# EAGLE design main (EAGLE 7.7.0)
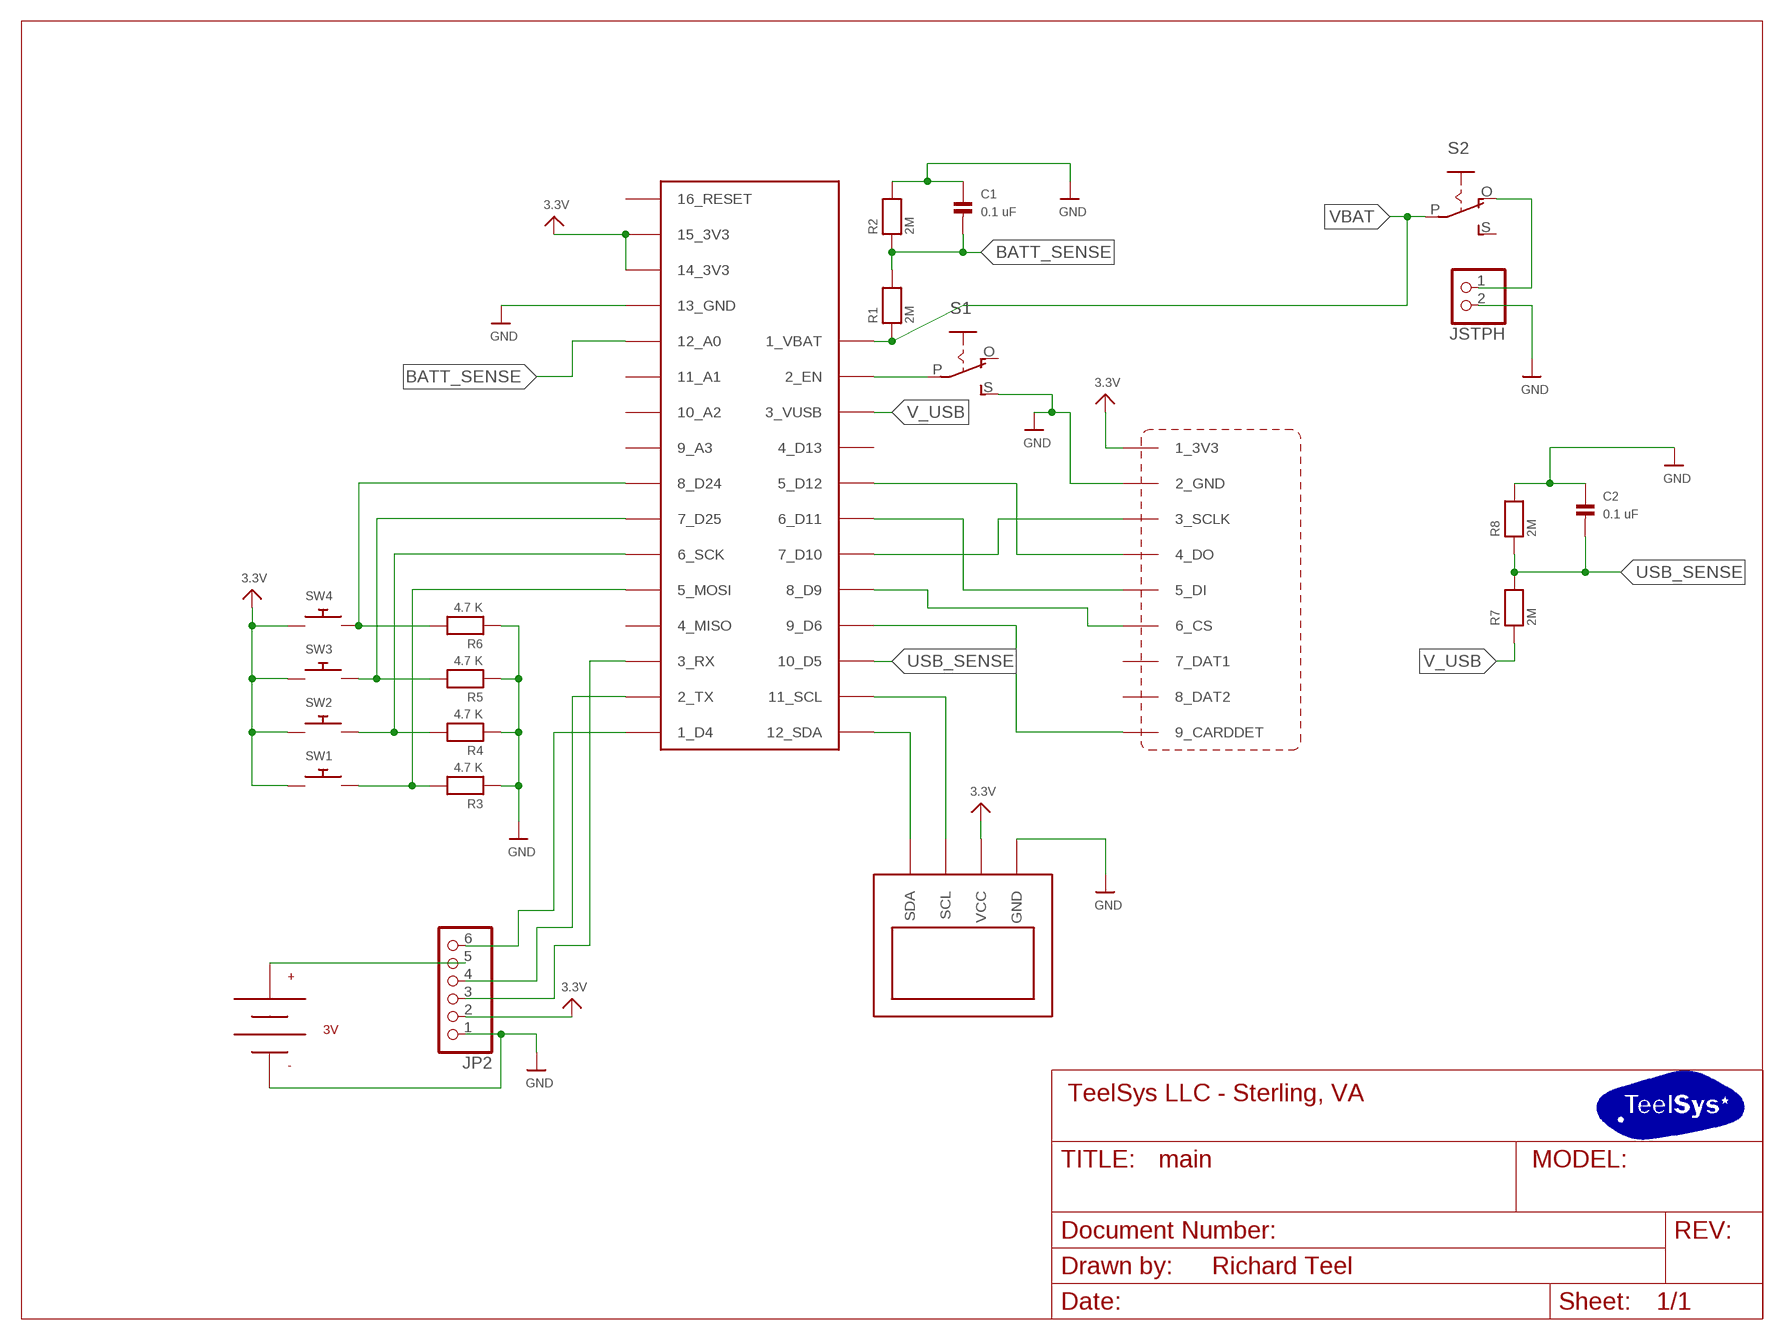
[diagram p0: schematic, sheet 1]
FRAME1 (LETTER_L): COMPANY_INFO: TeelSys LLC - Sterling, VA; DRAWN_BY: Richard Teel

## Parts
BAT_1  CR2032_HOLDER_WMYCONGCONG  [CR2032_HOLDER_WMYCONGCONG]
C1  0.1 uF  CAP_CERAMIC_0805  [_0805]
C2  0.1 uF  CAP_CERAMIC_0805  [_0805]
FEATHER_RP2040  ADAFRUIT_FEATHER_RP2040  [ADAFRUIT_FEATHER]
JP2  HEADER-1X6ROUND  [1X06_ROUND]
JSTPH  JST_2PIN-SMT-RA  [JST-PH-2-SMT-RA]
R1  2M  RESISTOR0805  [0805]
R2  2M  RESISTOR0805  [0805]
R3  4.7 K  RESISTOR0805  [0805]
R4  4.7 K  RESISTOR0805  [0805]
R5  4.7 K  RESISTOR0805  [0805]
R6  4.7 K  RESISTOR0805  [0805]
R7  2M  RESISTOR0805  [0805]
R8  2M  RESISTOR0805  [0805]
S1  EG1218S  [EG1218]
S2  EG1218S  [EG1218]
SDCARD2  ADAFRUIT_SDCARD3V3BOTTOM_MNT  [ADAFRUIT_SDCARD3V3_B]
SW1  SWITCH_PUSHBUTTONEVQ-PE  [TACT_PANA-EVQ]
SW2  SWITCH_PUSHBUTTONEVQ-PE  [TACT_PANA-EVQ]
SW3  SWITCH_PUSHBUTTONEVQ-PE  [TACT_PANA-EVQ]
SW4  SWITCH_PUSHBUTTONEVQ-PE  [TACT_PANA-EVQ]
U$10  OLED_SDD1306_128X64FRIENDA  [OLED_SDD1306_128X64]

## Nets
3.3V: FEATHER_RP2040.14_3V3 FEATHER_RP2040.15_3V3 JP2.2 SDCARD2.1_3V3 SW1.P$1 SW2.P$1 SW3.P$1 SW4.P$1 U$10.2_VCC(VCC)
BATT_SENSE: C1.2 FEATHER_RP2040.12_A0 R1.2 R2.1
GND: BAT_1.V-(-) C1.1 C2.1 FEATHER_RP2040.13_GND JP2.1 JSTPH.2 R2.2 R3.1 R4.1 R5.1 R6.1 R8.2 S1.S SDCARD2.2_GND U$10.1_GND(GND)
N$1: FEATHER_RP2040.9_D6 SDCARD2.9_CARDDET
N$2: FEATHER_RP2040.5_D12 SDCARD2.4_DO
N$3: FEATHER_RP2040.7_D10 SDCARD2.3_SCLK
N$4: FEATHER_RP2040.6_D11 SDCARD2.5_DI
N$5: FEATHER_RP2040.8_D9 SDCARD2.6_CS
N$7: FEATHER_RP2040.2_EN S1.P
N$8: FEATHER_RP2040.8_D24 R6.2 SW4.P$2
N$9: FEATHER_RP2040.7_D25 R5.2 SW3.P$2
N$10: FEATHER_RP2040.6_SCK R4.2 SW2.P$2
N$11: FEATHER_RP2040.5_MOSI R3.2 SW1.P$2
N$12: BAT_1.V+(+) JP2.5
N$13: FEATHER_RP2040.12_SDA U$10.4_SDA(SDA)
N$14: FEATHER_RP2040.11_SCL U$10.3_SCL(SCL)
N$17: JSTPH.1 S2.O
N$18: FEATHER_RP2040.3_RX JP2.3
N$19: FEATHER_RP2040.2_TX JP2.4
N$20: FEATHER_RP2040.1_D4 JP2.6
USB_SENSE: C2.2 FEATHER_RP2040.10_D5 R7.2 R8.1
V_USB: FEATHER_RP2040.3_VBUS(3_VUSB) R7.1
VBAT: FEATHER_RP2040.1_VBAT R1.1 S2.P
Unconnected: FEATHER_RP2040.4_D13 FEATHER_RP2040.4_MISO FEATHER_RP2040.9_A3 FEATHER_RP2040.10_A2 FEATHER_RP2040.11_A1 FEATHER_RP2040.16_RESET S1.O S2.S SDCARD2.7_DAT1 SDCARD2.8_DAT2

## Library data of the parts
BAT_1 = TeelSys-0.3:CR2032_HOLDER_WMYCONGCONG: https://smile.amazon.com/gp/product/B06XF3K4NP/ref=ppx_yo_dt_b_asin_image_o04_s00?ie=UTF8&psc=1 WMYCONGCONG 30 PCS CR2032 CR2025 Coin Button Cell Battery Holder Case, Black
C1 C2 = microbuilder:CAP_CERAMIC: Ceramic Capacitors 0402 - 0402 Surface Mount Capacitors 16pF 50V 5% [Digikey: 445-4899-2-ND] 18pF 50V 5% [Digikey: 490-1281-2-ND] 22pF 50V 5% [Digikey: 490-1283-2-ND] 68pF 50V 5% [Digikey: 490-1289-2-ND] 0.1uF 10V 10% [Digikey: 490-1318-2-ND] 1.0uF 6.3V 10% [Digikey: 490-1320-2-ND] 0603 - 0603 Surface Mount Capacitors 16 pF 50V 5% [Digikey: 445-5051-2-ND] 22 pF 50V [Digikey: PCC220ACVTR-ND] 33 pF 50V 5% [Digikey: 490-1415-1-ND] 56pF 50V 5% [Digikey: 490-1421-1-ND] 220pF 50V 5% [Digikey: 445-1285-1-ND] 680 pF 50V 2200 pF 50V 5% C0G [Digikey: 445-1297-1-ND] 5600 pF 100V 5% X7R [Digikey: 478-3711-1-ND] 0.1 µF 25V 10% [Digikey: PCC2277TR-ND] 0.22 µF 16V 10% X7R [Digikey: 445-1318-1-ND] 1.0 µF 25V 10% [Digikey: 445-5146-2-ND] 0603 - RF Specific 3pF 250V +/-0.1pF RF [Digikey: 712-1347-1-ND] 18 pF 250V 5% [Digikey: 478-3505-1-ND or 712-1322-1-ND] 56 pF 250V 5% C0G RF [Digikey: 490-4867-1-ND] 68 pF 250V RF [Digikey: 490-4868-1-ND] 0805 - 0805 Surface Mount Capacitors 220 pF 250V 2% RF Ceramic Capacitor [Digikey: 712-1398-1-ND] 1000 pF 50V 2% NP0 Ceramic Capacitor [Digikey: 478-3760-1-ND] 0.1 µF 25V 10% Ceramic Capacitor [Digikey: PCC1828TR-ND] 1.0 µF 16V 10% Ceramic Capacitor[Digikey: 490-1691-2-ND] 10.0 µF 10V 10% Ceramic Capacitor[Digikey: 709-1228-1-ND] 10.0 uF 16V 10% Ceramic Capacitor [Digikey: 478-5165-2-ND] 47 uF 6.3V 20% Ceramic Capacitor [Digikey: 587-1779-1-ND or 399-5506-1-ND] 1206 - 1206 Surface Mount Capacitors 47uF 10V 20% Ceramic Capacitor [Digikey: 490-5528-1-ND or 399-5508-1-ND or 445-6010-1-ND] 100uF 6.3V -20%, +80% Y5V Ceramic Capacitor (Digikey: 490-4512-1-ND, Mouser: 81-GRM31CF50J107ZE1L)
FEATHER_RP2040 = TeelSys-0.3:ADAFRUIT_FEATHER_RP2040; ADAFRUIT_PN: 4884
JP2 = microbuilder:HEADER-1X6: PIN HEADER
JSTPH = adafruit:JST_2PIN: JST 2-Pin Connectors of various flavors SMT-RA (S2B-PH-SM4) 4UConnector #17311 SMT (B2B-PH-SM4) THM-RA (S2B-PH) THM (B2B-PH)
R1-R8 = microbuilder:RESISTOR: Resistors 0402 - 0402 Surface Mount Package 22 Ohm 1% 1/16W [Digikey: 311-22.0LRTR-ND] 33 Ohm 5% 1/16W 1.0K 5% 1/16W 1.5K 5% 1/16W 2.0K 1% 1/16W 10.0K 1% 1/16W [Digikey: 311-10.0KLRTR-ND] 10.0K 5% 1/16W [Digikey: RMCF0402JT10K0TR-ND] 12.1K 1% 1/16W [Digikey: 311-22.0LRTR-ND] 100.0K 5% 1/16W 0603 - 0603 Surface Mount Package 0 Ohm 1/10 Watt 1% Resistor 15 Ohm 1/10 Watt 1% Resistor 33 Ohm 1/10 Watt 1% Resistor 49.9 Ohm 1/10 Watt 1% Resistor 100 Ohm 1/10 Watt 1% Resistor 150 Ohm 1/10 Watt 1% Resistor 240 Ohm 1/10 Watt 1% Resistor 390 Ohm 1/10 Watt 1% Resistor 560 Ohm 1/10 Watt 1% Resistor 680 Ohm 1/10 Watt 1% Resistor 750 Ohm 1/10 Watt 1% Resistor 1.0K Ohm 1/10 Watt 1% Resistor 1.5K Ohm 1/10 Watt 1% Resistor 2.0K Ohm 1/10 Watt 1% Resistor 2.2K Ohm 1/10 Watt 1% Resistor 3.3K Ohm 1/10 Watt 1% Resistor 4.7K Ohm 1/10 Watt 1% Resistor 10.0K Ohm 1/10 Watt 1% Resistor 12.0K Ohm 1/10 Watt 1% Resistor 12.1K Ohm 1/10 Watt 1% Resistor 20.0K Ohm 1/10 Watt 1% Resistor 33.0K Ohm 1/10 Watt 1% Resistor 100.0K Ohm 1/10 Watt 1% Resistor 0805 - 0805 Surface Mount Package 0 Ohm 1/8 Watt 1% Resistor 33 Ohm 1/8 Watt 1% Resistor 100 Ohm 1/8 Watt 1% Resistor 150 Ohm 1/8 Watt 1% Resistor 200 Ohm 1/8 Watt 1% Resistor 240 Ohm 1/8 Watt 1% Resistor 330 Ohm 1/8 Watt 1% Resistor 390 Ohm 1/8 Watt 1% Resistor 470 Ohm 1/8 Watt 1% Resistor 1.0K Ohm 1/8 Watt 1% Resistor 1.5K Ohm 1/8 Watt 1% Resistor 2.0K Ohm 1/8 Watt 1% Resistor 4.7K Ohm 1/8 Watt 1% Resistor 5.1K Ohm 1/8 Watt 1% Resistor 5.6K Ohm 1/8 Watt 1% Resistor 10.0K Ohm 1/8 Watt 1% Resistor 22.0K Ohm 1/8 Watt 1% Resistor 33.0K Ohm 1/8 Watt 1% Resistor 100K Ohm 1/8 Watt 1% Resistor 1206 - 1206 Surface Mount Package 2012 - 2010 Surface Mount Package 0.11 Ohm 1/2 Watt 1% Resistor - Digikey: RHM.11UCT-ND
S1 S2 = adafruit:EG1218: SLIDING SWITCH 0.1" spacing through hole, vertical SPDT slide switch http://www.ladyada.net/library/pcb/eaglelibrary.html
SDCARD2 = TeelSys-0.3:ADAFRUIT_SDCARD3V3: https://www.adafruit.com/product/4682
SW1-SW4 = adafruit:SWITCH_PUSHBUTTON: Buttons SOFTTOUCHSMD_SJ - Soft touch temporary push button (Super Junk Akihabara) Compatible with SKPMANE010 [Mouser: 688-SKPMAN] C&K_KSS = Digikey: KSS221GLFS
U$10 = TeelSys-0.3:OLED_SDD1306_128X64: Amazon - https://smile.amazon.com/gp/product/B08QJ7BL3R/ref=ppx_yo_dt_b_asin_image_o05_s00?ie=UTF8&th=1 Frienda 5 Pieces 0.96 Inch OLED Module 12864 128x64 Driver IIC I2C Serial Self-Luminous Display Board Compatible with Arduino Raspberry PI (Blue)

## Board
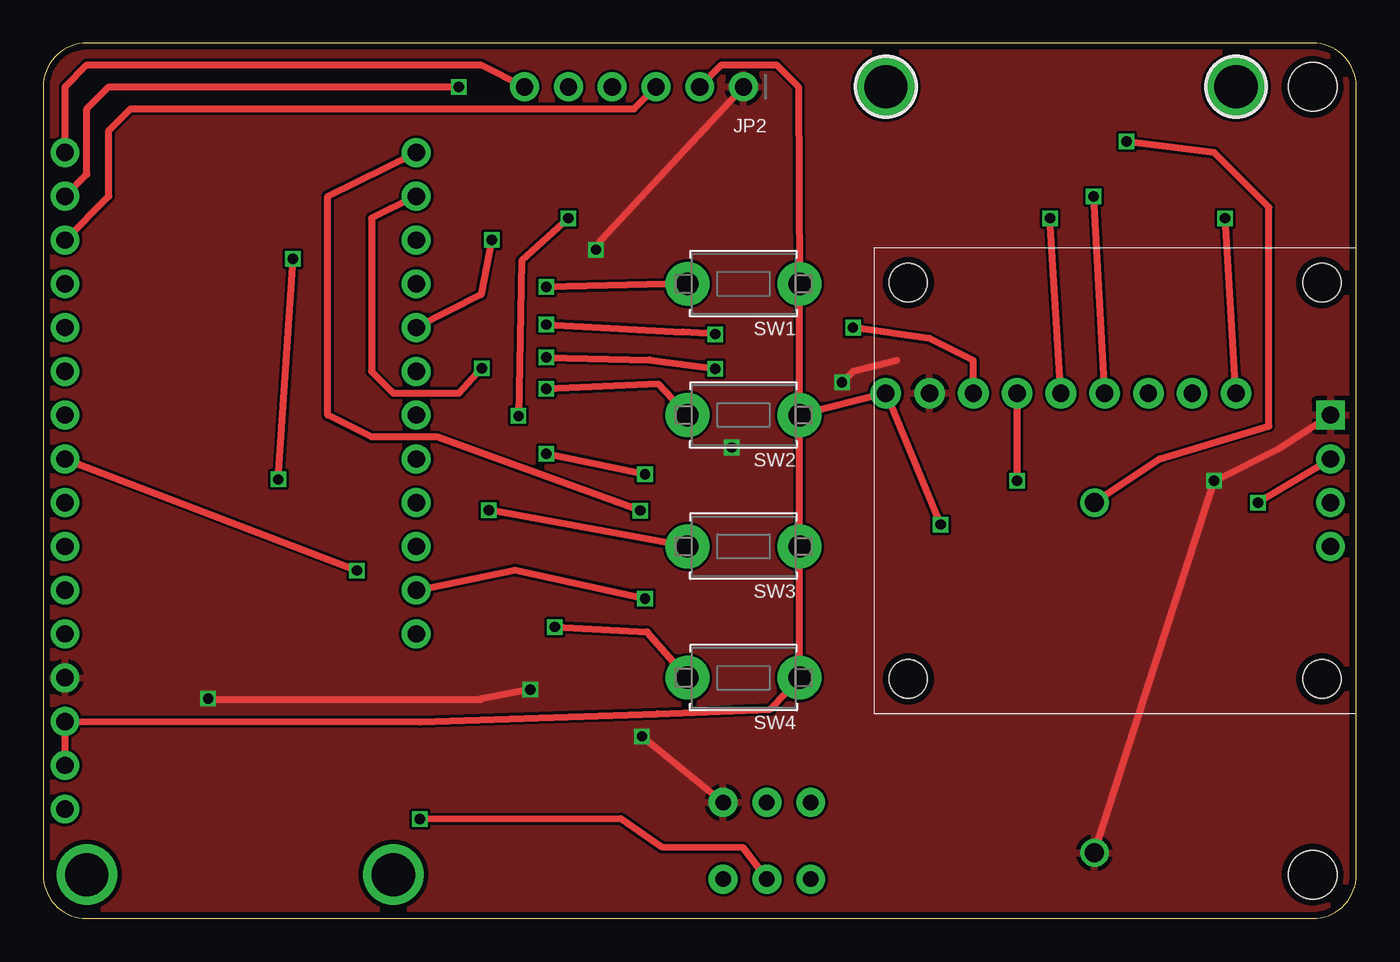
[diagram p1: board, top side]
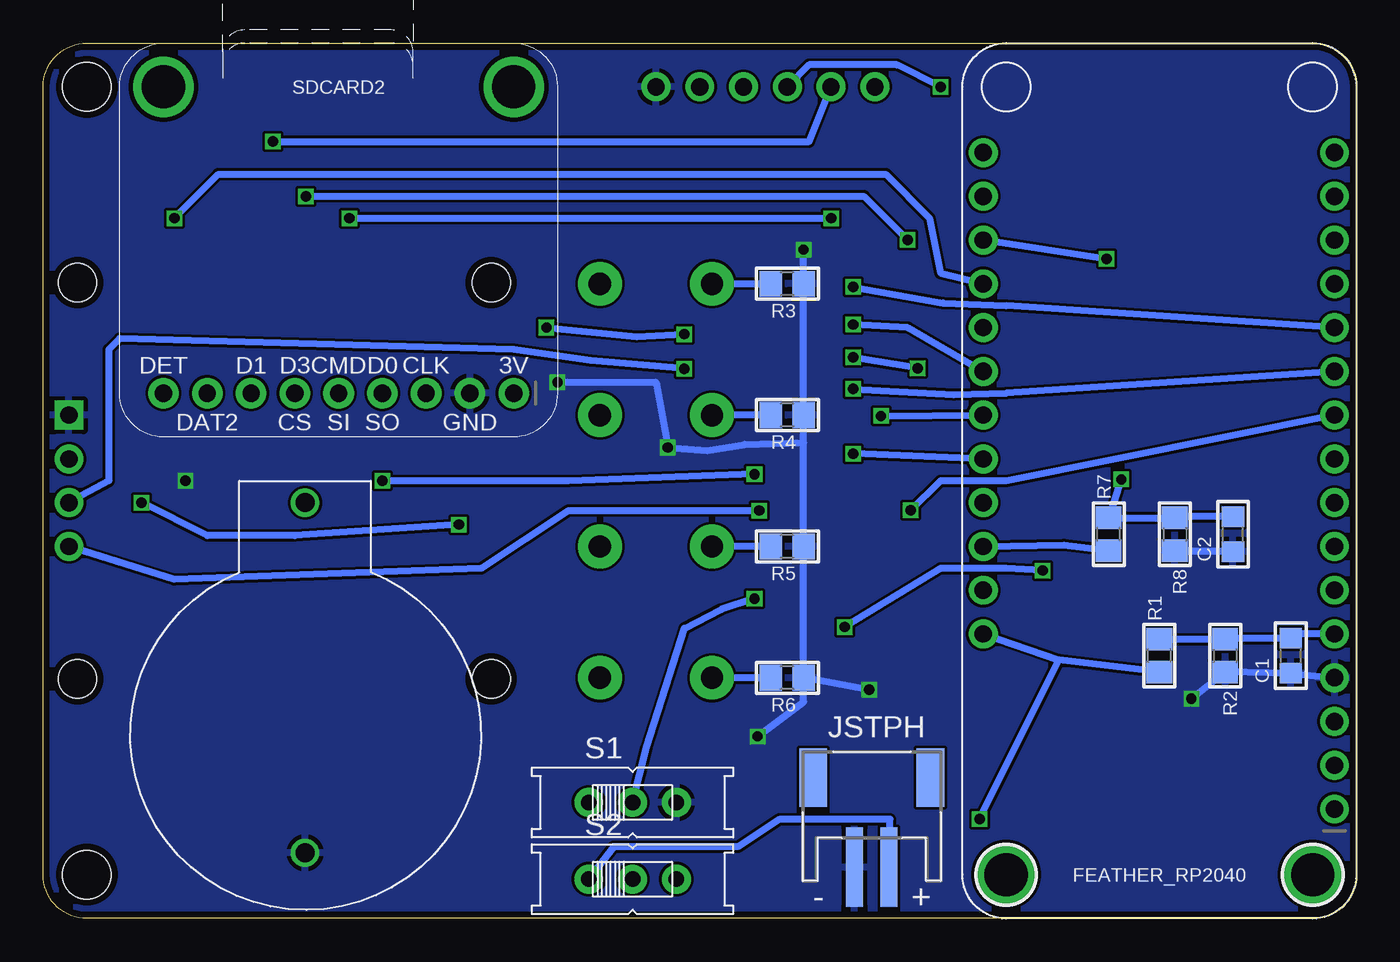
[diagram p2: board, bottom side, seen from below]

Size 76.2 x 50.8 mm. Coordinates in mm from the lower left corner, seen from the top.
Outline: 0,48.26 0,2.54 arc90 2.54,0 73.66,0 arc90 76.2,2.54 76.2,48.26 arc90 73.66,50.8 2.54,50.8 arc90 0,48.26
Copper layers (1*16): Top 0.035559375mm / dielectric 1.6mm / Bottom 0.035559375mm
Design rules "oshpark-2layer2020": minimum track width 6mil, minimum drill 10mil, track to track 6mil, track to pad 6mil, pad to pad 6mil, via to via 6mil, smd to smd 6mil, copper to edge 15mil, drill to drill 6mil, minimum pad ring 5mil, minimum via ring 5mil, stop-mask expansion 2.5mil, vias tented up to drill 0mil, thermal gap 10mil
Holes 2.8 mm at 73.66,48.26 73.66,2.54

### Footprints (pad centres in the part's own frame; a part is rotated, then mirrored left to right if it is on the bottom)
CR2032_HOLDER_WMYCONGCONG = drill 1.1: V+ 20.32,0; V- 0,0
_0805 = smd 1.2 x 1.3: 1 -1.016,0; 2 1.016,0
ADAFRUIT_FEATHER = drill 1 pad 1.676: 1_D4 44.45,1.27; 1_VBAT 16.51,21.654; 2_EN 19.05,21.654; 2_TX 41.91,1.27; 3_RX 39.37,1.27; 3_VBUS 21.59,21.654; 4_D13 24.13,21.654; 4_MISO 36.83,1.27; 5_D12 26.67,21.654; 5_MOSI 34.29,1.27; 6_D11 29.21,21.654; 6_SCK 31.75,1.27; 7_D10 31.75,21.654; 7_D25 29.21,1.27; 8_D9 34.29,21.654; 8_D24 26.67,1.27; 9_A3 24.13,1.27; 9_D6 36.83,21.654; 10_A2 21.59,1.27; 10_D5 39.37,21.654; 11_A1 19.05,1.27; 11_SCL 41.91,21.654; 12_A0 16.51,1.27; 12_SDA 44.45,21.654; 13_GND 13.97,1.27; 14_3V3 11.43,1.27; 15_3V3 8.89,1.27; 16_RESET 6.35,1.27 | drill 2.5 pad 3.2: P$1 2.54,20.32; P$2 2.54,2.54
1X06_ROUND = drill 1 pad 1.676: 1 -6.35,0; 2 -3.81,0; 3 -1.27,0; 4 1.27,0; 5 3.81,0; 6 6.35,0
JST-PH-2-SMT-RA = smd 1 x 4.6: 1 1,-3.7; 2 -1,-3.7 | smd 1.6 x 3.4: NC1 -3.4,1.5; NC2 3.4,1.5
0805 = smd 1.3 x 1.5: 1 -0.95,0; 2 0.95,0
EG1218 = drill 0.9 pad 1.676: O -2.54,0; P 0,0; S 2.54,0
ADAFRUIT_SDCARD3V3_B = drill 1 pad 1.778: 1_3V3 2.54,2.54; 2_GND 5.08,2.54; 3_SCLK 7.62,2.54; 4_DO 10.16,2.54; 5_DI 12.7,2.54; 6_CS 15.24,2.54; 7_DAT1 17.78,2.54; 8_DAT2 20.32,2.54; 9_CARDDET 22.86,2.54 | drill 2.5 pad 3.2: P$1 22.86,20.32; P$2 2.54,20.32
TACT_PANA-EVQ = drill 1.3 pad 2.54: P$1 -3.25,0; P$2 3.25,0
OLED_SDD1306_128X64 = drill 1 pad 1.676 square: 1_GND 9.69,26.5 | drill 1 pad 1.676: 2_VCC 12.23,26.5; 3_SCL 14.77,26.5; 4_SDA 17.31,26.5 | hole 2.2: 2,26; 25,26; 25,2; 2,2

### Placement (x,y rotation side)
BAT_1  61,3.81 90 bottom
C1  3.81,15.25 90 bottom
C2  7.16,22.3 90 bottom
FEATHER_RP2040  0,0 90 bottom
JP2  34.29,48.26 180 top
JSTPH  28.12,6.68 0 bottom
R1  11.43,15.25 90 bottom
R2  7.62,15.25 270 bottom
R3  33.02,36.83 180 bottom
R4  33.02,29.21 180 bottom
R5  33.02,21.59 180 bottom
R6  33.02,13.97 180 bottom
R7  14.38,22.3 90 bottom
R8  10.54,22.3 270 bottom
S1  42,6.73 0 bottom
S2  42,2.29 0 bottom
SDCARD2  46.35,27.94 0 top
SW1  40.64,36.83 180 top
SW2  40.64,29.21 180 top
SW3  40.64,21.59 180 top
SW4  40.64,13.97 180 top
U$10  48.2,38.9 270 top

### Tracks (layer width: path | path; a pad name or v marks a point on that pad's centre or on a via)
3.3V  (via drill 0.6)
  Top 0.406: SW2.P$1 SW3.P$1 SW4.P$1 42.19,12.14 35.64,11.89 21.87,11.4 FEATHER_RP2040.14_3V3 FEATHER_RP2040.15_3V3 | SW2.P$1 SW1.P$1 43.81,48.26 42.55,49.53 39.37,49.53 JP2.2 | v70.48,24.13 U$10.2_VCC | v52.07,22.86 SDCARD2.1_3V3 SW2.P$1
  Bottom 0.406: v52.07,22.86 61.59,22.23 66.67,22.23 v70.48,24.13
BATT_SENSE
  Bottom 0.406: FEATHER_RP2040.12_A0 3.81,16.51 C1.2 7.62,16.27 R2.1 R1.2
GND  (via drill 0.6)
  Top 0.406: 25.3,12.7 9.53,12.7 v9.58,12.75 | 25.3,12.7 25.4,12.7 | JP2.1 32.38,39.37 v32.08,38.81 | 49.53,32.38 46.99,31.75 v46.35,31.11 | U$10.1_GND 71.75,27.3 v67.94,25.4 BAT_1.V- | S1.S v34.75,10.57 | v28.27,13.28 25.3,12.7
  Bottom 0.406: R6.1 32,13.99 v28.27,13.28 | v46.35,31.11 40.64,31.11 v39.95,27.33 37.67,27.15 35.48,27.51 32.07,27.61 | 10.54,21.31 R8.2 10.54,21.28 C2.1 | v34.75,10.57 32.08,12.57 R6.1 | R6.1 R5.1 32.07,27.61 | 32.07,27.61 R4.1 R3.1 v32.08,38.81 | FEATHER_RP2040.13_GND C1.1 R2.2 v9.58,12.75
  pour Bottom: 0,0 76.2,0 76.2,50.8 0,50.8
  pour Top: 0,0 76.2,0 76.2,50.8 0,50.8
N$1  (via drill 0.6)
  Top 0.406: SDCARD2.9_CARDDET v68.58,40.64
  Bottom 0.406: v68.58,40.64 66.04,43.18 27.3,43.18 24.77,40.64 24.13,37.47 FEATHER_RP2040.9_D6
N$2  (via drill 0.6)
  Top 0.406: v29.2,26.98 v34.92,25.78 | SDCARD2.4_DO v56.52,25.4
  Bottom 0.406: FEATHER_RP2040.5_D12 v29.2,26.98 | v56.52,25.4 45.72,25.4 34.9,25.81 v34.92,25.78
N$3  (via drill 0.6)
  Top 0.406: v46.99,34.29 51.44,33.66 53.98,32.38 SDCARD2.3_SCLK | v29.2,34.47 37.11,34.04 v39,33.91
  Bottom 0.406: FEATHER_RP2040.7_D10 26.04,34.29 v29.2,34.47 | v46.99,34.29 41.76,33.76 v39,33.91
N$4  (via drill 0.6)
  Top 0.406: v30.48,40.64 27.76,38.18 v27.58,29.16 | SDCARD2.5_DI v58.42,40.64
  Bottom 0.406: v58.42,40.64 v30.48,40.64 | v27.58,29.16 FEATHER_RP2040.6_D11
N$5  (via drill 0.6)
  Top 0.406: v26.04,39.37 25.4,36.2 FEATHER_RP2040.8_D9 | SDCARD2.6_CS v60.96,41.91
  Bottom 0.406: v60.96,41.91 28.57,41.91 v26.04,39.37
N$7  (via drill 0.6)
  Top 0.406: FEATHER_RP2040.2_EN 27.38,20.22 v34.92,18.57
  Bottom 0.406: S1.P 41.2,9.93 38.99,16.84 36.85,17.93 v34.92,18.57
N$8  (via drill 0.6)
  Top 0.406: v29.69,16.92 35.05,16.64 SW4.P$2 | FEATHER_RP2040.8_D24 v18.21,20.19
  Bottom 0.406: v29.69,16.92 24.13,20.32 20.32,20.32 v18.21,20.19 | R6.2 SW4.P$2
N$9  (via drill 0.6)
  Top 0.406: SW3.P$2 v25.86,23.7
  Bottom 0.406: FEATHER_RP2040.7_D25 20.32,25.4 24.13,25.4 v25.86,23.7 | R5.2 SW3.P$2
N$10  (via drill 0.6)
  Top 0.406: SW2.P$2 35.71,31.01 v29.2,30.73
  Bottom 0.406: FEATHER_RP2040.6_SCK 20.32,30.48 23.37,30.4 v29.2,30.73 | R4.2 SW2.P$2
N$11  (via drill 0.6)
  Top 0.406: SW1.P$2 v29.2,36.65
  Bottom 0.406: FEATHER_RP2040.5_MOSI 20.32,35.56 23.98,35.71 v29.2,36.65 | SW1.P$2 R3.2
N$12  (via drill 0.6)
  Top 0.406: v62.87,45.09 67.94,44.45 71.12,41.27 71.12,28.57 64.77,26.67 BAT_1.V+
  Bottom 0.406: v62.87,45.09 31.75,45.09 JP2.5
N$13  (via drill 0.6)
  Top 0.406: v34.65,23.67 22.86,27.94 19.05,27.94 16.51,29.21 16.51,41.91 FEATHER_RP2040.12_SDA
  Bottom 0.406: v34.65,23.67 45.72,23.67 50.8,20.32 68.58,19.68 U$10.4_SDA
N$14  (via drill 0.6)
  Top 0.406: FEATHER_RP2040.11_SCL 19.05,40.64 19.05,31.75 20.32,30.48 24.13,30.48 v25.45,31.93 | v29.2,32.56 35.2,32.41 v39,31.9
  Bottom 0.406: U$10.3_SCL 72.39,25.4 72.39,33.02 71.75,33.66 48.9,33.02 44.45,32.38 v39,31.9 | v25.45,31.93 v29.2,32.56
N$17
  Bottom 0.406: JSTPH.1 27.05,2.98 27.05,5.77 33.48,5.74 35.89,4.17 43.1,4.17 S2.O
N$18
  Top 0.406: FEATHER_RP2040.3_RX 3.81,41.91 3.81,45.72 5.08,46.99 34.29,46.99 JP2.3
N$19  (via drill 0.6)
  Top 0.406: FEATHER_RP2040.2_TX 2.54,43.18 2.54,46.99 3.81,48.26 v24.13,48.26
  Bottom 0.406: v24.13,48.26 26.67,49.53 31.75,49.53 JP2.4
N$20
  Top 0.406: FEATHER_RP2040.1_D4 1.27,48.26 2.54,49.53 25.4,49.53 JP2.6
USB_SENSE  (via drill 0.6)
  Top 0.406: v13.64,25.48 v14.5,38.28
  Bottom 0.406: 10.54,23.34 R8.1 | v14.5,38.28 FEATHER_RP2040.10_D5 | C2.2 10.54,23.32 R8.1 | R8.1 R7.2 14.33,23.25 v13.64,25.48
V_USB
  Bottom 0.406: FEATHER_RP2040.3_VBUS 16.97,21.67 R7.1
VBAT  (via drill 0.6)
  Top 0.406: v21.87,5.77 33.53,5.79 35.92,4.14 40.62,4.12 S2.P
  Bottom 0.406: v21.87,5.77 17.27,15 | R1.1 17.27,15 | FEATHER_RP2040.1_VBAT 17.27,15